# Altium schematic sheet Jack_In.SchDoc
size Letter
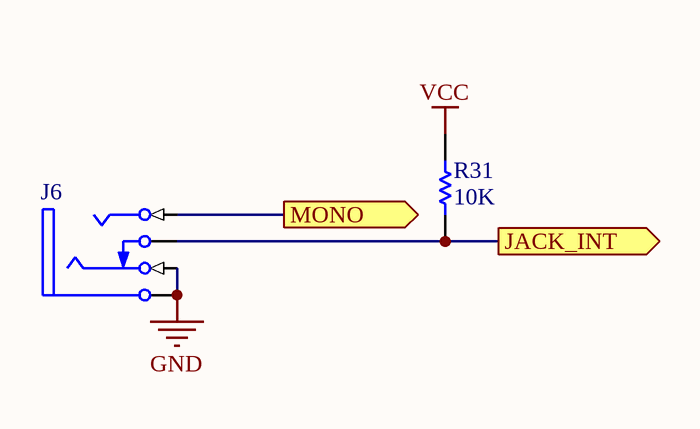
[diagram p0: Jack_In.SchDoc]

## Parts
J6  Phonejack3 RN  [MHDR1X4]  (value not drawn)
R31  value 10K  [AXIAL-0.3]  (hidden comment: Res1)

## Ports
JACK_INT (out), MONO (out)

## Nets
GND: J6.3(R) J6.5(S)
VCC: R31.2
JACK_INT: J6.4(RN) R31.1 ; port JACK_INT
MONO: J6.1(T) ; port MONO

## Library data of the parts
J6 = Phonejack3 RN: Jack Socket, 1/4" [6.5mm], Thru-Hole, Vertical, 3-Conductor with Tip open & Ring closed; PackageDocument: 2003; PCB_Layout: Complies with manufacturer's recommendation.; DrillAndSlotSize: Corresponds to nominal value.; Published: 15-Jul-2004; DatasheetDocument: 2003; PackageReference: S1VS_SBS; Publisher: Altium Limited; ComponentLink1Description: Manufacturer Link; ComponentLink1URL: http://www.cliffuk.co.uk/
R31 = Res1: Resistor; Published: 8-Jun-2000; LatestRevisionDate: 17-Jul-2002; LatestRevisionNote: Re-released for DXP Platform.; PackageReference: AXIAL-0.3; Publisher: Altium Limited; PackageDescription: Axial Device, Thru-Hole; 2 Leads; 0.3 in Pin Spacing